# EAGLE design FitzSPA10 (EAGLE 6.5.0)
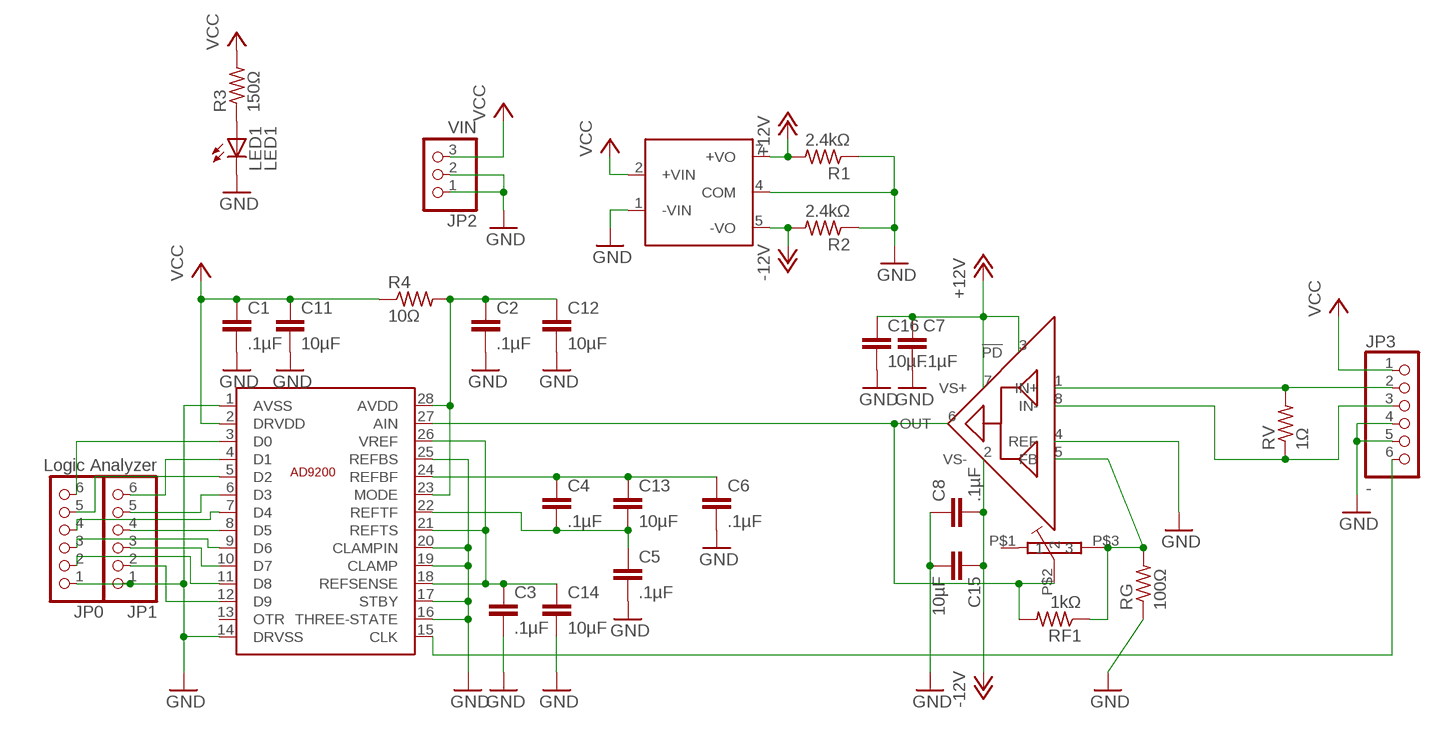
[diagram p0: schematic, sheet 1]

## Parts
C1  .1µF  C-EUC0603  [C0603]
C2  .1µF  C-EUC0603  [C0603]
C3  .1µF  C-EUC0603  [C0603]
C4  .1µF  C-EUC0603  [C0603]
C5  .1µF  C-EUC0603  [C0603]
C6  .1µF  C-EUC0603  [C0603]
C7  .1µF  C-EUC0603  [C0603]
C8  .1µF  C-EUC0603  [C0603]
C11  10µF  C-EUC0805  [C0805]
C12  10µF  C-EUC0805  [C0805]
C13  10µF  C-EUC0805  [C0805]
C14  10µF  C-EUC0805  [C0805]
C15  10µF  C-EUC0805  [C0805]
C16  10µF  C-EUC0805  [C0805]
JP0  PINHD-1X6LOCK  [1X06-BIGLOCK]
JP1  Logic Analyzer  PINHD-1X6LOCK  [1X06-BIGLOCK]
JP2  VIN  PINHD-1X3  [1X03]
JP3  -  PINHD-1X6LOCK  [1X06-BIGLOCK]
LED1  LED1  LEDCHIPLED_0603  [CHIPLED_0603]
R1  2.4kΩ  R-US_R0603  [R0603]
R2  2.4kΩ  R-US_R0603  [R0603]
R3  150Ω  R-US_R0603  [R0603]
R4  10Ω  R-US_R0603  [R0603]
RF  10kΩ  MODEL84POT  [MODEL84POT]
RF1  1kΩ  R-US_R0603  [R0603]
RG  100Ω  R-US_R0603  [R0603]
RV  1Ω  R-US_R0603  [R0603]
U1  AD9200ARZ  [SSOP28]
U2  AD8129ARMZ  [MSOP8]
U3  VAT1-SMT  [VAT1-SMT]

## Nets
+12V: C7.1 C16.1 R1.2 U2.3(!PD) U2.7(VS+) U3.7(+VO)
-12V: C8.2 C15.1 R2.2 U2.2(VS-) U3.5(-VO)
GND: C1.2 C2.2 C3.2 C5.2 C6.2 C7.2 C8.1 C11.2 C12.2 C14.2 C15.2 C16.2 JP0.1 JP1.1 JP2.1 JP2.2 JP3.4 JP3.5 LED1.C R1.1 R2.1 RG.1 U1.1(AVSS) U1.14(DRVSS) U1.16(THREE-STATE) U1.17(STBY) U1.19(CLAMP) U1.20(CLAMPIN) U1.25(REFBS) U2.4(REF) U3.1(-VIN) U3.4(COM)
N$1: RF1.2 RF.P$2 U1.27(AIN) U2.6(OUT)
N$2: JP1.6 U1.4(D1)
N$3: RF1.1 RF.P$3 RG.2 U2.5(FB)
N$4: C4.1 C6.1 C13.1 U1.24(REFBF)
N$5: JP1.5 U1.6(D3)
N$6: JP3.3 RV.1 U2.8(IN-)
N$7: C4.2 C5.1 C13.2 U1.22(REFTF)
N$8: C3.1 C14.1 U1.18(REFSENSE) U1.21(REFTS) U1.26(VREF)
N$9: JP1.4 U1.8(D5)
N$10: JP1.3 U1.10(D7)
N$11: JP1.2 U1.12(D9)
N$12: JP0.6 U1.3(D0)
N$13: JP0.5 U1.5(D2)
N$14: JP0.4 U1.7(D4)
N$15: JP0.3 U1.9(D6)
N$16: JP0.2 U1.11(D8)
N$17: LED1.A R3.1
N$18: JP3.2 RV.2 U2.1(IN+)
N$21: JP3.6 U1.15(CLK)
N$22: C2.1 C12.1 R4.2 U1.23(MODE) U1.28(AVDD)
VCC: C1.1 C11.1 JP2.3 JP3.1 R3.2 R4.1 U1.2(DRVDD) U3.2(+VIN)
Unconnected: RF.P$1 U1.13(OTR)

## Library data of the parts
C1-C8 C11-C16 = rcl:C-EU: CAPACITOR, European symbol
JP0 JP1 JP3 = adafruit:PINHD-1X6: PIN HEADER
JP2 = adafruit:PINHD-1X3: PIN HEADER
LED1 = adafruit:LED: LED OSRAM: - CHIPLED LG R971, LG N971, LY N971, LG Q971, LY Q971, LO R971, LY R971 LH N974, LH R974 LS Q976, LO Q976, LY Q976 LO Q996 - Hyper CHIPLED LW Q18S LB Q993, LB Q99A, LB R99A - SideLED LS A670, LO A670, LY A670, LG A670, LP A670 LB A673, LV A673, LT A673, LW A673 LH A674 LY A675 LS A676, LA A676, LO A676, LY A676, LW A676 LS A679, LY A679, LG A679 - Hyper Micro SIDELED® LS Y876, LA Y876, LO Y876, LY Y876 LT Y87S - SmartLED LW L88C, LW L88S LB L89C, LB L89S, LG L890 LS L89K, LO L89K, LY L89K LS L896, LA L896, LO L896, LY L896 - TOPLED LS T670, LO T670, LY T670, LG T670, LP T670 LSG T670, LSP T670, LSY T670, LOP T670, LYG T670 LG T671, LOG T671, LSG T671 LB T673, LV T673, LT T673, LW T673 LH T674 LS T676, LA T676, LO T676, LY T676, LB T676, LH T676, LSB T676, LW T676 LB T67C, LV T67C, LT T67C, LS T67K, LO T67K, LY T67K, LW E67C LS E67B, LA E67B, LO E67B, LY E67B, LB E67C, LV E67C, LT E67C LW T67C LS T679, LY T679, LG T679 LS T770, LO T770, LY T770, LG T770, LP T770 LB T773, LV T773, LT T773, LW T773 LH T774 LS E675, LA E675, LY E675, LS T675 LS T776, LA T776, LO T776, LY T776, LB T776 LHGB T686 LT T68C, LB T68C - Hyper Mini TOPLED® LB M676 - Mini TOPLED Santana® LG M470 LS M47K, LO M47K, LY M47K Source: http://www.osram.convergy.de/
R1-R4 RF1 RG RV = rcl:R-US_: RESISTOR, American symbol
RF = Model84POT:MODEL84POT
U1 = ad9200:AD9200: 10-Bit, 20 MSPS, 80 mW CMOS A/D Converter
U2 = AD8129:AD8129: Low Cost 200 MHz Differential Receiver Amplifier
U3 = VAT1-SMT:VAT1-SMT: DC-DC CONVERTER

## Board
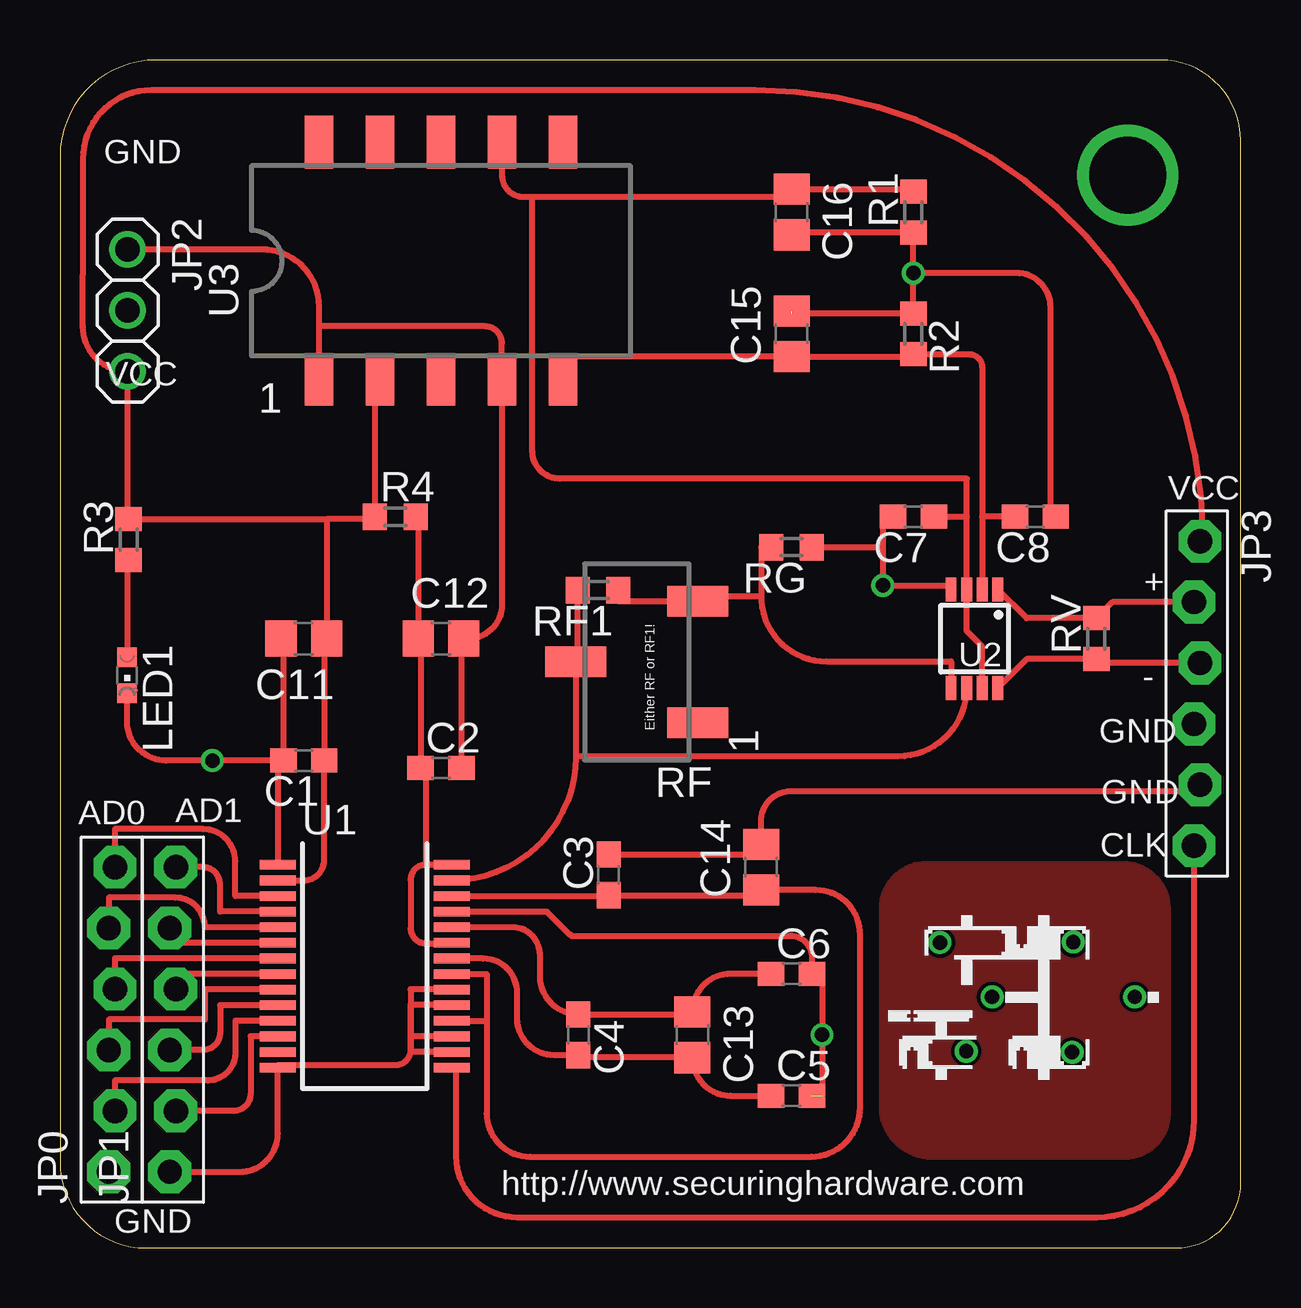
[diagram p1: board, top side]
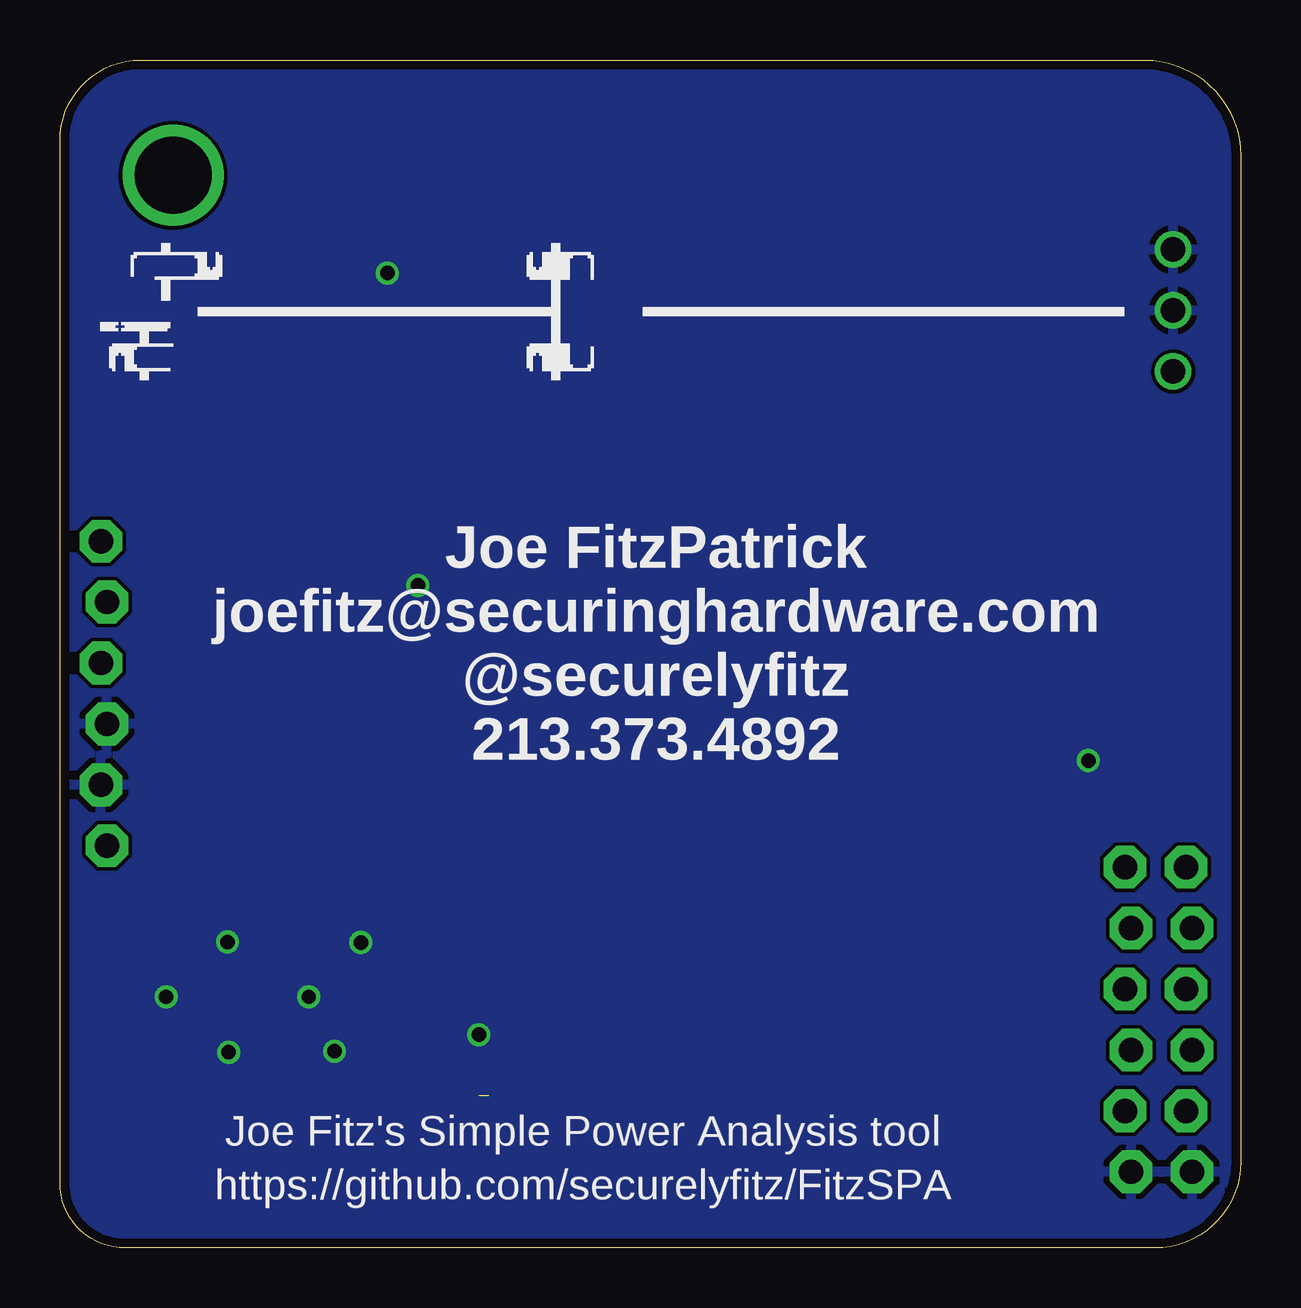
[diagram p2: board, bottom side, seen from below]

Size 49.2 x 49.52 mm. Coordinates in mm from the lower left corner, seen from the top.
Outline: 0,45.51 0,3.59 arc90 3.59,0 46.49,0 arc90 49.2,2.71 49.2,46.16 arc90 45.84,49.52 4.01,49.52 arc90 0,45.51
Copper layers (1*16): Top 0.0356mm / dielectric 1.5011mm / Bottom 0.0356mm
Design rules "LaenPCBOrder": minimum track width 6mil, minimum drill 13mil, track to track 6mil, track to pad 6mil, pad to pad 6mil, via to via 6mil, smd to smd 6mil, copper to edge 15mil, drill to drill 6mil, minimum pad ring 7mil, minimum via ring 7mil, stop-mask expansion 4mil, vias tented up to drill 0mil, thermal gap 10mil

### Footprints (pad centres in the part's own frame; a part is rotated, then mirrored left to right if it is on the bottom)
C0603 = smd 1.1 x 1: 1 -0.85,0; 2 0.85,0
C0805 = smd 1.3 x 1.5: 1 -0.95,0; 2 0.95,0
1X06-BIGLOCK = drill 1.016 pad 1.778 octagon: 1 -6.35,0.127; 2 -3.81,-0.127; 3 -1.27,0.127; 4 1.27,-0.127; 5 3.81,0.127; 6 6.35,-0.127
1X03 = drill 1.016: 1 -2.54,0; 2 0,0; 3 2.54,0
CHIPLED_0603 = smd 0.8 x 0.8: A 0,-0.75; C 0,0.75
R0603 = smd 1 x 1.1: 1 -0.85,0; 2 0.85,0
MODEL84POT = smd 1.27 x 2.54: P$1 -2.54,-2.54; P$2 0,2.54; P$3 2.54,-2.54
SSOP28 = smd 0.4 x 1.5: 1 -4.225,-3.625; 2 -3.575,-3.625; 3 -2.925,-3.625; 4 -2.275,-3.625; 5 -1.625,-3.625; 6 -0.975,-3.625; 7 -0.325,-3.625; 8 0.325,-3.625; 9 0.975,-3.625; 10 1.625,-3.625; 11 2.275,-3.625; 12 2.925,-3.625; 13 3.575,-3.625; 14 4.225,-3.625; 15 4.225,3.625; 16 3.575,3.625; 17 2.925,3.625; 18 2.275,3.625; 19 1.625,3.625; 20 0.975,3.625; 21 0.325,3.625; 22 -0.325,3.625; 23 -0.975,3.625; 24 -1.625,3.625; 25 -2.275,3.625; 26 -2.925,3.625; 27 -3.575,3.625; 28 -4.225,3.625
MSOP8 = smd 0.45 x 1: 1 -0.975,-2.05; 2 -0.325,-2.05; 3 0.325,-2.05; 4 0.975,-2.05; 5 0.975,2.05; 6 0.325,2.05; 7 -0.325,2.05; 8 -0.975,2.05
VAT1-SMT = smd 1.2 x 2.2: 1 -5.08,-4.943; 2 -2.54,-4.943; 3 0,-4.943; 4 2.54,-4.943; 5 5.08,-4.943; 6 5.08,4.943; 7 2.54,4.943; 8 0,4.943; 9 -2.54,4.943; 10 -5.08,4.943

### Placement (x,y rotation side)
C1  10.16,20.32 180 top
C2  15.88,20 0 top
C3  22.86,15.56 90 top
C4  21.59,8.89 270 top
C5  30.48,6.35 0 top
C6  30.48,11.43 0 top
C7  35.56,30.48 180 top
C8  40.64,30.48 180 top
C11  10.16,25.4 180 top
C12  15.88,25.4 0 top
C13  26.35,8.89 270 top
C14  29.21,15.88 90 top
C15  30.48,38.1 90 top
C16  30.48,43.18 270 top
JP0  2.16,9.53 90 top
JP1  4.7,9.53 90 top
JP2  2.82,39.08 270 top
JP3  47.37,23.11 270 top
LED1  2.79,23.88 180 top
R1  35.56,43.18 90 top
R2  35.56,38.1 270 top
R3  2.86,29.53 90 top
R4  13.97,30.48 0 top
RF  24.04,24.43 90 top
RF1  22.41,27.42 180 top
RG  30.48,29.21 180 top
RV  43.18,25.4 90 top
U1  12.7,11.75 270 top
U2  38.1,25.4 180 top
U3  15.88,41.15 0 top
U$4  [SH-HALFINCH]  34.13,6.17 0 top
U$5  [SECURINGHARDWAREDOTCOM]  47.85,35.48 0 bottom

### Tracks (layer width: path | path; a pad name or v marks a point on that pad's centre or on a via)
+12V
  Top 0.254: U3.7 18.41,44.71 arc90 19.31,43.81 19.68,43.81 | 19.68,43.81 30.48,43.81 C16.1 35.56,44.13 R1.2 | U2.7 38.42,25.07 37.78,25.72 37.78,27.44 U2.3 37.78,27.45 37.78,30.48 | 37.78,30.48 37.78,32.07 20.83,32.07 arc-90 19.68,33.21 19.68,43.81 | C7.1 37.78,30.48
-12V
  Top 0.254: U3.5 20.95,37.15 C15.1 35.56,37.15 R2.2 37.89,37.25 arc-90 38.42,36.72 38.42,30.48 | 38.42,30.48 U2.2 | C8.2 38.42,30.48
GND  (via drill 0.6)  (2 unrouted)
  Top 0.254: JP1.1 7.49,3.17 arc90 9.07,4.76 U1.14 9.07,7.62 13.97,7.62 arc90 14.61,8.26 14.61,10.77 U1.20 16.32,10.79 14.61,10.79 14.61,10.16 | 9.21,15.97 U1.1 9.07,20.32 C1.2 | C1.2 v6.35,20.32 4.42,20.32 arc-90 2.79,21.95 LED1.C | C11.2 9.31,25.4 C1.2 | U1.16 14.61,8.17 14.61,8.82 | U1.17 14.61,8.82 | 14.61,8.82 14.61,10.16 | 14.61,10.16 16.32,10.16 U1.19 | 31.75,6.35 v31.75,8.89 31.75,11.43 C6.2 31.33,12.11 arc90 30.42,13.02 21.32,13.02 arc-90 21.27,13.07 arc-45 21.18,13.11 20.32,13.97 arc88 20.27,14.02 U1.25 | C2.2 16.73,25.4 C12.2 17,25.4 arc90 18.41,26.82 U3.4 18.41,37.71 arc90 17.7,38.42 10.79,38.42 | C3.2 29.21,16.41 C14.2 29.21,17.78 arc-90 30.48,19.05 47.5,19.05 JP3.5 | C16.2 30.48,42.33 R1.1 v35.56,40.64 | v35.56,40.64 R2.1 30.48,38.95 | C8.1 41.27,30.48 41.27,39.22 arc90 39.85,40.64 v35.56,40.64 | C7.2 34.29,30.48 34.29,29.21 | 34.29,29.21 v34.29,27.62 37.12,27.62 U2.4 | RG.1 34.29,29.21 | 10.79,38.42 10.79,39.25 arc90 8.43,41.62 JP2.1 | U3.1 10.79,38.42
  other vias: 36.66,12.73 38.84,10.47 37.76,8.2 42.17,8.16 44.78,10.47 42.22,12.75
  pour Bottom: 0,45.94 0,2.84 arc90 2.84,0 46.69,0 arc90 49.53,2.84 49.53,45.94 arc90 45.94,49.53 3.59,49.53 arc90
N$1
  Top 0.254: 37.78,23.35 U2.6 arc-90 34.92,20.49 21.5,20.49 | 21.5,20.49 RF.P$2 21.5,24.88 arc90 21.56,24.95 RF1.2 | 21.5,20.49 arc-90 U1.27
N$2
  Top 0.254: U1.4 6.67,14.02 6.67,15.16 arc90 5.96,15.88 JP1.6
N$3
  Top 0.254: RG.2 29.21,29.21 29.21,27.18 | 29.21,27.18 arc90 31.94,24.45 37.12,24.45 U2.5 | 29.21,27.18 26.79,27.18 arc90 RF.P$3 23.27,26.97 arc90 RF1.1
N$4
  Top 0.254: C6.1 27.94,11.43 arc90 C13.1 26.67,9.74 C4.1 arc-90 20,11.33 20,12.21 arc90 18.84,13.37 U1.24
N$5
  Top 0.254: U1.6 4.57,12.72 JP1.5
N$6
  Top 0.254: JP3.3 43.35,24.38 RV.1 40.27,24.55 U2.8
N$7
  Top 0.254: C5.1 27.94,6.35 arc-90 C13.2 21.59,7.94 C4.2 20.58,8.04 arc-90 19.05,9.57 19.05,10.64 arc90 17.63,12.06 U1.22
N$8
  Top 0.254: U1.26 22.86,14.67 C3.1 29.21,14.71 C14.1 31.49,14.92 arc-90 33.34,13.07 33.34,5.84 arc-90 31.3,3.81 19.58,3.81 arc-90 17.78,5.61 17.78,9.47 | U1.18 17.78,9.47 | U1.21 17.77,11.42 arc-90 17.78,11.41 17.78,9.47
N$9
  Top 0.254: U1.8 4.83,11.42 JP1.4
N$10
  Top 0.254: U1.10 6.67,10.12 6.67,8.96 arc-90 5.96,8.26 JP1.3
N$11
  Top 0.254: U1.12 7.94,8.82 7.94,6.42 arc-90 7.23,5.71 JP1.2
N$12
  Top 0.254: U1.3 7.3,14.67 7.3,16.11 arc90 5.96,17.46 2.29,17.46 JP0.6
N$13
  Top 0.254: U1.5 6.03,13.37 arc90 4.8,14.61 2.03,14.61 JP0.5
N$14
  Top 0.254: U1.7 2.29,12.07 JP0.4
N$15
  Top 0.254: U1.9 6.03,10.77 6.03,9.53 2.03,9.53 JP0.3
N$16
  Top 0.254: U1.11 7.3,9.47 7.3,8.13 arc-90 6.16,6.99 2.29,6.99 JP0.2
N$17
  Top 0.254: R3.1 2.79,28.68 LED1.A
N$18
  Top 0.254: JP3.2 43.85,26.92 RV.2 40.27,26.25 U2.1
N$19
  pour Top: 34.34,5.87 34.34,14.15 arc-90 36.11,15.93 44.29,15.93 arc-90 46.06,14.17 46.06,5.56 arc-90 44.39,3.89 36.32,3.89 arc-90
N$20  (via drill 3.2)
  other vias: 44.49,44.71
N$21
  Top 0.254: 16.51,7.52 U1.15 arc-90 16.51,7.34 16.51,3.81 arc90 19.05,1.27 43.18,1.27 arc90 47.24,5.33 JP3.6
N$22
  Top 0.254: U1.28 15.24,15.97 | 15.24,15.97 arc90 14.61,15.34 14.61,13.34 arc90 15.24,12.7 16.32,12.7 U1.23 | R4.2 14.93,30.48 C12.1 15.03,25.4 C2.1 15.24,20 15.24,15.97
VCC
  Top 0.254: 11.11,30.38 R3.2 arc-90 2.82,30.42 JP2.3 arc-90 0.95,38.41 0.95,40.58 0.95,41.1 0.95,45.4 arc-90 3.81,48.26 28.96,48.26 arc-90 47.62,29.59 arc-90 JP3.1 | 11.11,30.38 13.12,30.38 R4.1 13.12,36.2 U3.2 | 11.11,30.38 C11.1 11.01,25.4 C1.1 11.01,16.18 arc-90 10.16,15.32 U1.2

### Text on the board
tPlace: GND | VCC | VCC | + | - | Either RF or RF1! | GND | GND | AD0 | AD1 | CLK | http://www.securinghardware.com | GND
bPlace: Joe FitzPatrick / joefitz@securinghardware.com / @securelyfitz / 213.373.4892 | Joe Fitz's Simple Power Analysis tool | https://github.com/securelyfitz/FitzSPA
tStop: FitzSPA 1.0
bStop: FitzSPA 1.0
tDocu: + | + | + | + | +